# Altium schematic sheet I2C Buffer.SchDoc
size A4; Organization: TESLA Motors, INC; Address1: 3500 Deer Creek Road; Address2: Palo Alto, CA; Address4: U.S.A.; SheetNumber: 13; SheetTotal: 17
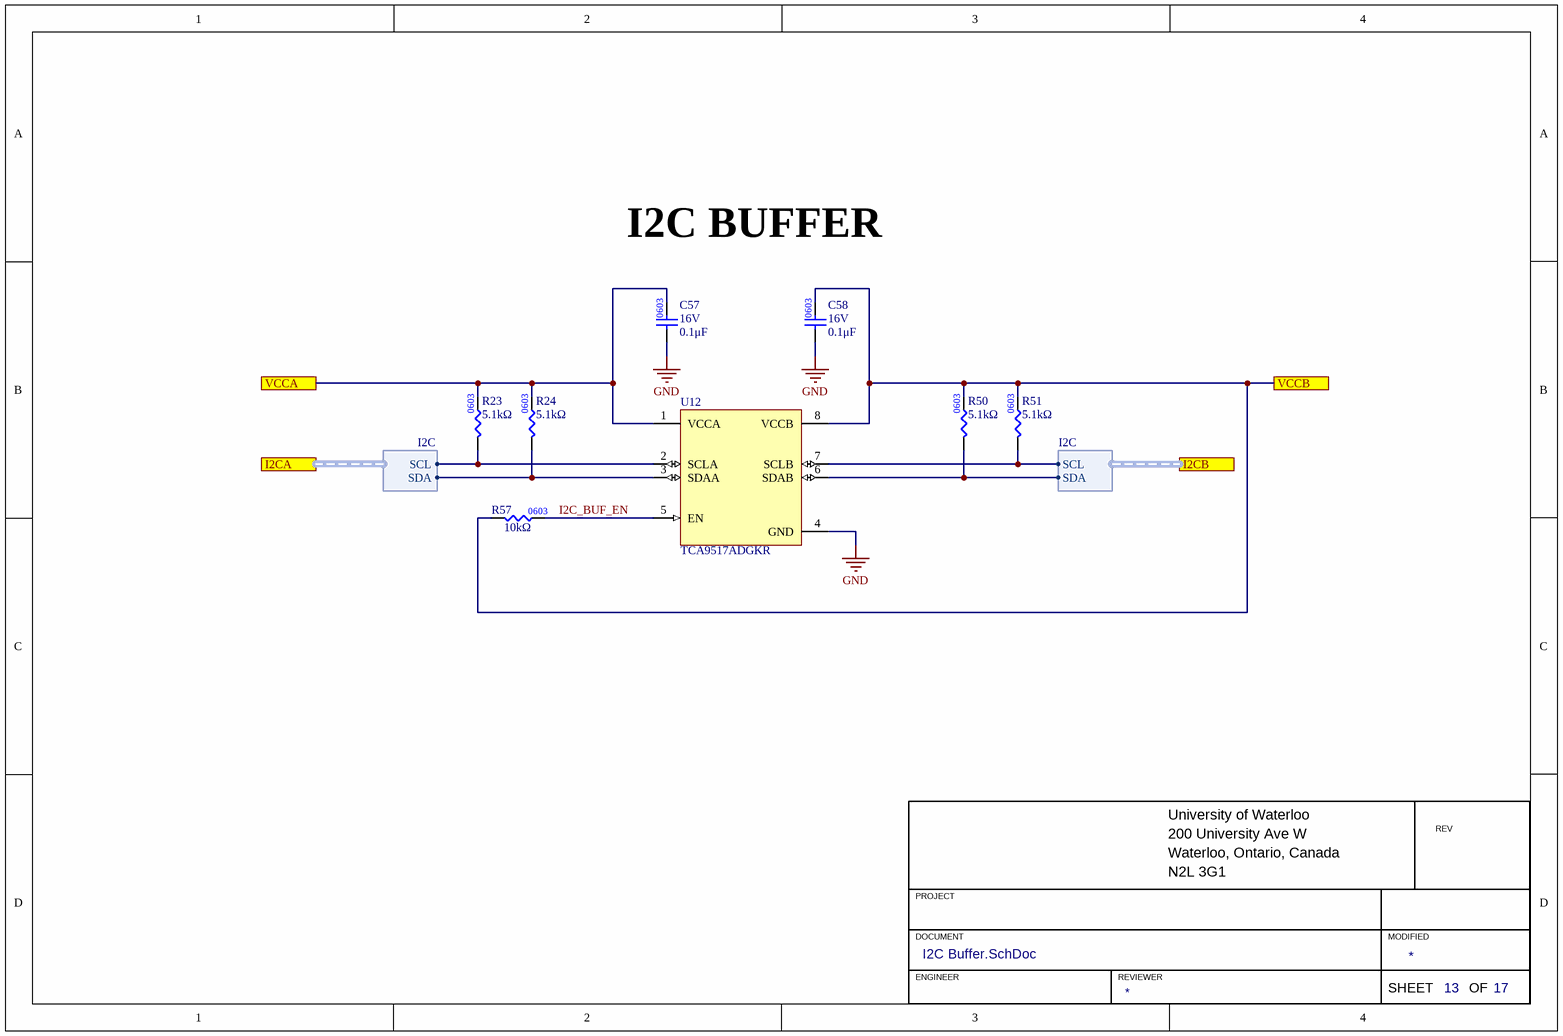
[diagram p0: I2C Buffer.SchDoc]

## Parts
C57  value 0.1μF  Voltage Rating: 16V  [CAP0603]  (hidden comment: CAP_0.1uF_16V_0603)
C58  value 0.1μF  Voltage Rating: 16V  [CAP0603]  (hidden comment: CAP_0.1uF_16V_0603)
R23  value 5.1kΩ  [RES0603]  (hidden comment: RES_5.1kΩ_0603_1%)
R24  value 5.1kΩ  [RES0603]  (hidden comment: RES_5.1kΩ_0603_1%)
R50  value 5.1kΩ  [RES0603]  (hidden comment: RES_5.1kΩ_0603_1%)
R51  value 5.1kΩ  [RES0603]  (hidden comment: RES_5.1kΩ_0603_1%)
R57  value 10kΩ  [RES0603]  (hidden comment: RES_10kΩ_0603_1%)
U12  TCA9517ADGKR  [TI_8-VSSOP]

## Ports
I2CA (harness I2C, see Real Time Clock[4B]), I2CB (harness I2C, see Real Time Clock[3B]), VCCA (see Real Time Clock[4B]), VCCB (see Real Time Clock[3B])

## Harnesses
I2C: SDA, SCL

## Nets
GND: C57.1 C58.1 U12.4(GND)
I2C_BUF_EN: R57.2 U12.5(EN)
VCCA: C57.2 R23.2 R24.2 U12.1(VCCA) ; port VCCA
VCCB: C58.2 R50.2 R51.2 R57.1 U12.8(VCCB) ; port VCCB
NetR23_1: R23.1 U12.2(SCLA) ; port I2CA.SCL
NetR24_1: R24.1 U12.3(SDAA) ; port I2CA.SDA
NetR50_1: R50.1 U12.6(SDAB) ; port I2CB.SDA
NetR51_1: R51.1 U12.7(SCLB) ; port I2CB.SCL

## Notes on the sheet
- I2C BUFFER
- University of Waterloo
- 200 University Ave W
- REV
- PROJECT
- Waterloo, Ontario, Canada
- N2L 3G1
- DOCUMENT
- ENGINEER
- REVIEWER
- MODIFIED
- SHEET
- OF

## Library data of the parts
C57 C58 = CAP_0.1uF_16V_0603: CAP CER 0.1UF 16V X7R 0603; Manufacturer Part Number 1: CC0603KRX7R7BB104; Manufacturer 1: Yageo; Package: 0603; Supplier Part Number 1: 311-1088-1-ND; Supplier 1: Digi-Key; Dielectric: X7R
R23 R24 R50 R51 = RES_5.1kΩ_0603_1%: RES 5.1K OHM 1% 1/10W 0603; Manufacturer 1: YAGEO; Manufacturer Part Number 1: RC0603FR-135K1L; Mounting Type: SMD; Package: 0603; Supplier 1: Digi-Key; Supplier Part Number 1: 13-RC0603FR-135K1LCT-ND
R57 = RES_10kΩ_0603_1%: RES 10K OHM 1% 1/8W 0603; Manufacturer 1: Stackpole Electronics Inc; Manufacturer Part Number 1: RNCP0603FTD10K0; Supplier Part Number 1: RNCP0603FTD10K0CT-ND; Supplier 1: Digi-Key; Mounting Type: SMD; Package: 0603
U12 = TCA9517ADGKR: IC XLTR VL BIDIR 8-VSSOP; Manufacturer 1: Texas Instruments; Package/Footprint: 8-TSSOP; Manufacturer Part Number 1: TCA9517ADGKR; Supplier 1: Digikey; Supplier Part Number 1: 296-39220-1-ND